# Altium project FEV-60_Motor_uC.PrjPcb
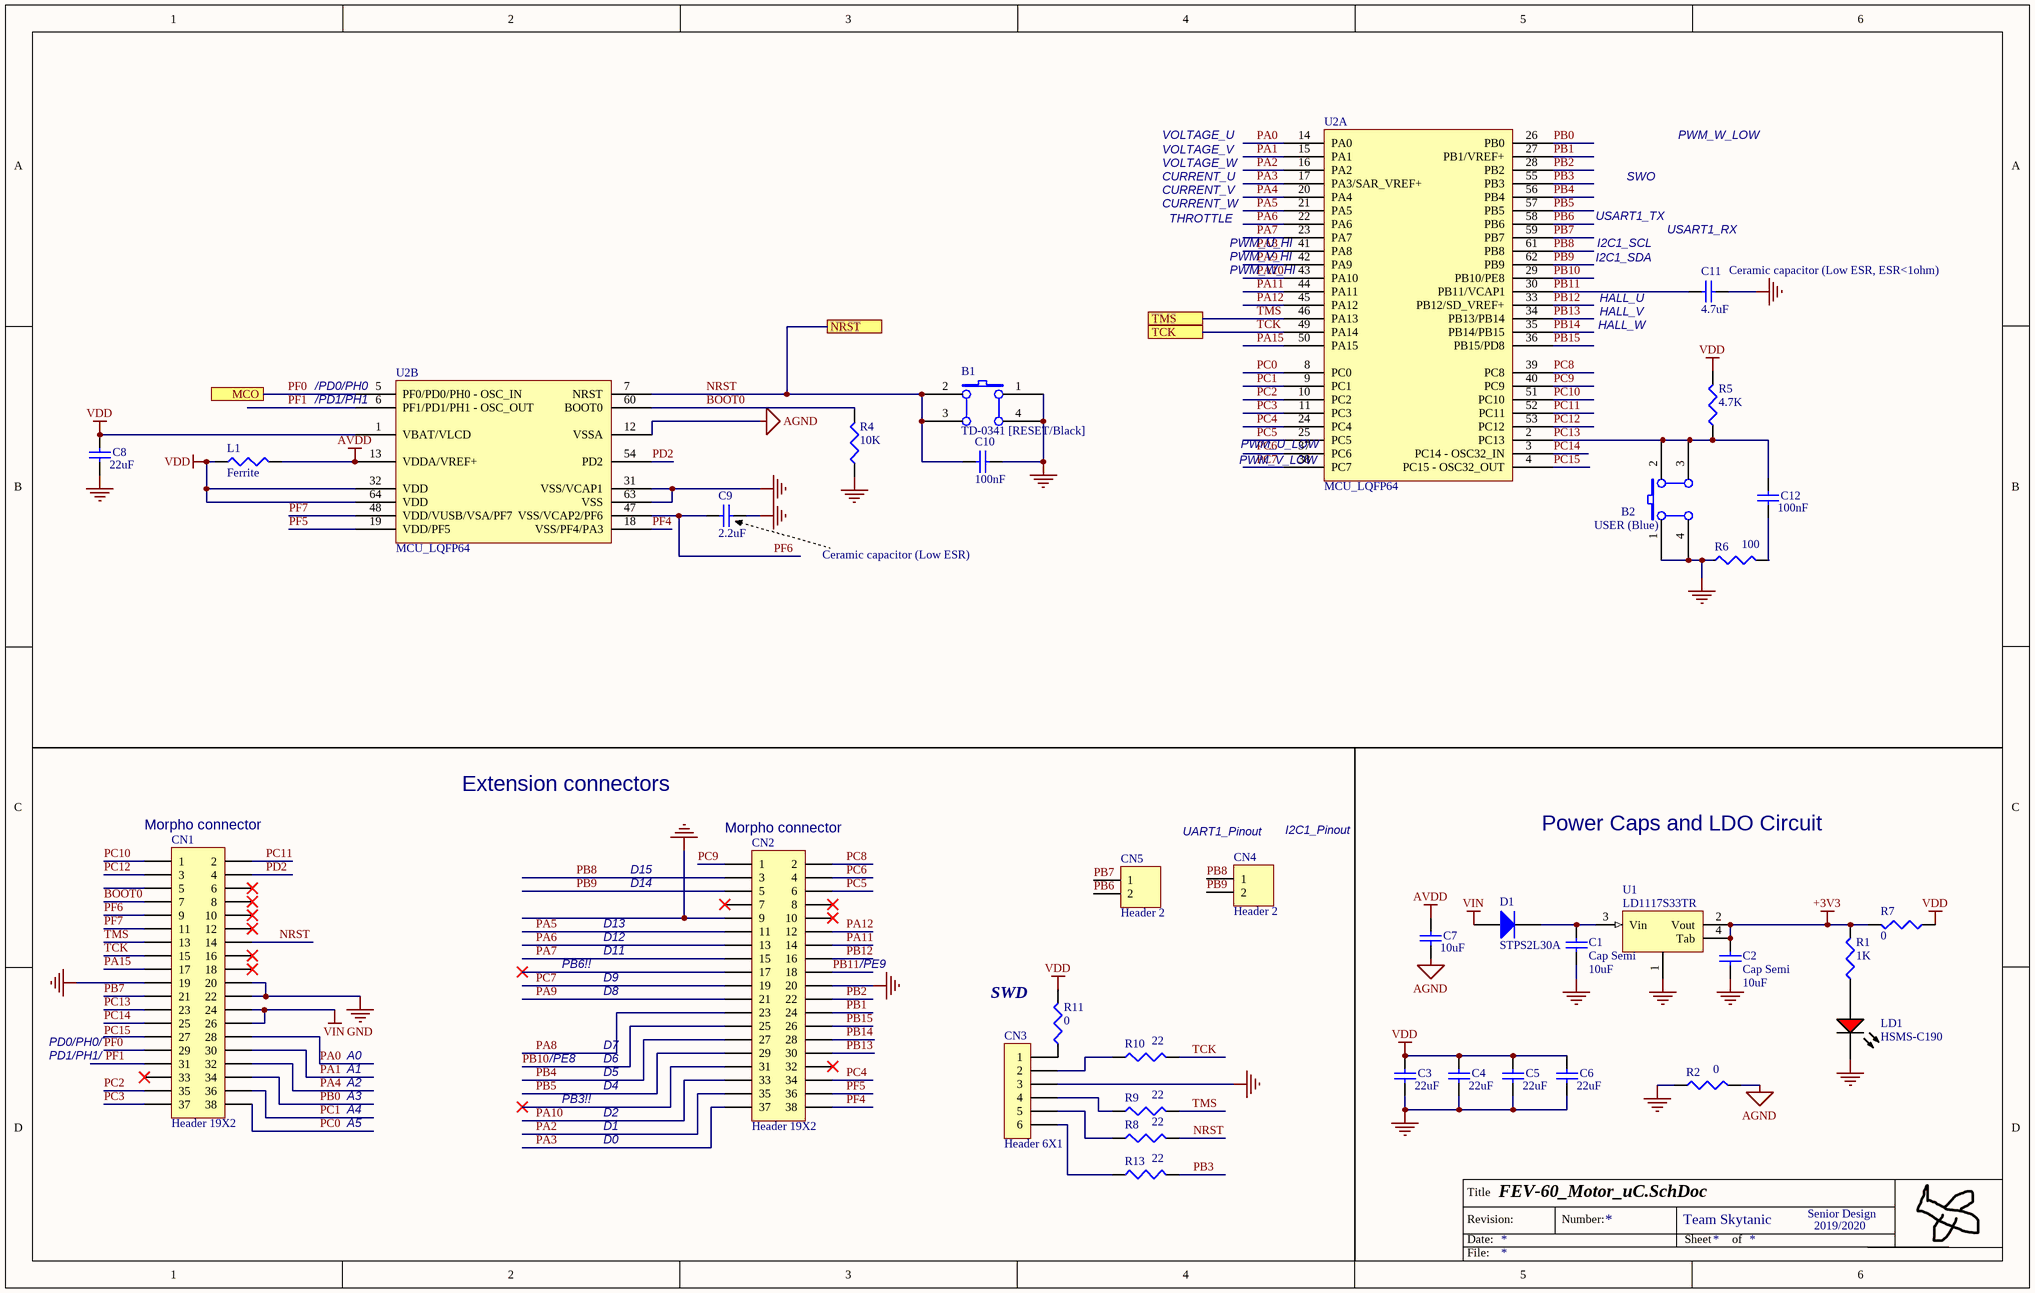
[diagram p0: FEV-60_Motor_uC.SchDoc]
1 sheet, 35 parts. Net scope: flat (ports and power ports of the same name join across sheets).
Board file: FEV-60_Motor_uC.PcbDoc

## Sheet FEV-60_Motor_uC.SchDoc
size B

### Parts
B1  TD-0341 [RESET/Black]  [Button]
B2  USER (Blue)  [Button]
C1  Cap Semi  value 10uF  [1608[0603]]
C2  Cap Semi  value 10uF  [1608[0603]]
C3  value 22uF  [1608[0603]]  (hidden comment: Cap Semi)
C4  value 22uF  [1608[0603]]  (hidden comment: Cap Semi)
C5  value 22uF  [1608[0603]]  (hidden comment: Cap Semi)
C6  value 22uF  [1608[0603]]  (hidden comment: Cap Semi)
C7  value 10uF  [1608[0603]]  (hidden comment: Cap Semi)
C8  value 22uF  [1608[0603]]  (hidden comment: Cap Semi)
C9  value 2.2uF  [1608[0603]]  (hidden comment: Cap Semi)
C10  value 100nF  [1608[0603]]  (hidden comment: Cap Semi)
C11  value 4.7uF  [1608[0603]]  (hidden comment: Cap Semi)
C12  value 100nF  [1608[0603]]  (hidden comment: Cap Semi)
CN1  Header 19X2  [HDR2X19]
CN2  Header 19X2  [HDR2X19]
CN3  Header 6X1  [HDR1X6]
CN4  Header 2  [HDR1X2]
CN5  Header 2  [HDR1X2]
D1  STPS2L30A  [STPS2L30A]
L1  Ferrite  [J1-0603]
LD1  HSMS-C190  [AVAG-HSMX-C190_V]
R1  value 1K  [J1-0603]  (hidden comment: Res3)
R2  value 0  [J1-0603]  (hidden comment: Res3)
R4  value 10K  [J1-0603]  (hidden comment: Res3)
R5  value 4.7K  [J1-0603]  (hidden comment: Res3)
R6  value 100  [J1-0603]  (hidden comment: Res3)
R7  value 0  [J1-0603]  (hidden comment: Res3)
R8  value 22  [J1-0603]  (hidden comment: Res3)
R9  value 22  [J1-0603]  (hidden comment: Res3)
R10  value 22  [J1-0603]  (hidden comment: Res3)
R11  value 0  [J1-0603]  (hidden comment: Res3)
R13  value 22  [J1-0603]  (hidden comment: Res3)
U1  LD1117S33TR  [LD1117S33TR]
U2  MCU_LQFP64  [STM32F030R8]  (parts A,B of 2)

### Ports
MCO, NRST, TCK, TMS

### Nets
+3V3: C2.2 R1.2 R7.2 U1.2(Vout) U1.4(Tab)
AGND: C7.1 R2.2 U2.12(VSSA)
AVDD: C7.2 L1.2 U2.13(VDDA/VREF+)
GND: B1.1(A0) B1.4(A1) B2.1(A0) B2.4(A1) C1.1 C2.1 C3.1 C4.1 C5.1 C6.1 C8.1 C9.1 C10.1 C11.1 CN1.19 CN1.20 CN1.22 CN2.9 CN2.20 CN3.3 LD1.2(K) R2.1 R4.1 R6.1 U1.1 U2.31(VSS/VCAP1) U2.63(VSS)
VDD: C3.2 C4.2 C5.2 C6.2 C8.2 L1.1 R5.2 R7.1 R11.2 U2.1(VBAT/VLCD) U2.32(VDD) U2.64(VDD)
VIN: CN1.24 CN1.26 D1.1(A)
BOOT0: CN1.7 R4.2 U2.60(BOOT0)
NRST: B1.2(B0) B1.3(B1) C10.2 CN1.14 R8.2 U2.7(NRST) ; port NRST
PA0: CN1.28 U2.14(PA0)
PA1: CN1.30 U2.15(PA1)
PA2: CN2.35 U2.16(PA2)
PA3: CN2.37 U2.17(PA3/SAR_VREF+)
PA4: CN1.32 U2.20(PA4)
PA5: CN2.11 U2.21(PA5)
PA6: CN2.13 U2.22(PA6)
PA7: CN2.15 U2.23(PA7)
PA8: CN2.23 U2.41(PA8)
PA9: CN2.21 U2.42(PA9)
PA10: CN2.33 U2.43(PA10)
PA11: CN2.14 U2.44(PA11)
PA12: CN2.12 U2.45(PA12)
PA15: CN1.17 U2.50(PA15)
PB0: CN1.34 U2.26(PB0)
PB1: CN2.24 U2.27(PB1/VREF+)
PB2: CN2.22 U2.28(PB2)
PB3: R13.2 U2.55(PB3)
PB4: CN2.27 U2.56(PB4)
PB5: CN2.29 U2.57(PB5)
PB6: CN5.2 U2.58(PB6)
PB7: CN1.21 CN5.1 U2.59(PB7)
PB8: CN2.3 CN4.1 U2.61(PB8)
PB9: CN2.5 CN4.2 U2.62(PB9)
PB10: CN2.25 U2.29(PB10/PE8)
PB11: C11.2 CN2.18 U2.30(PB11/VCAP1)
PB12: CN2.16 U2.33(PB12/SD_VREF+)
PB13: CN2.30 U2.34(PB13/PB14)
PB14: CN2.28 U2.35(PB14/PB15)
PB15: CN2.26 U2.36(PB15/PD8)
PC0: CN1.38 U2.8(PC0)
PC1: CN1.36 U2.9(PC1)
PC2: CN1.35 U2.10(PC2)
PC3: CN1.37 U2.11(PC3)
PC4: CN2.34 U2.24(PC4)
PC5: CN2.6 U2.25(PC5)
PC6: CN2.4 U2.37(PC6)
PC7: CN2.19 U2.38(PC7)
PC8: CN2.2 U2.39(PC8)
PC9: CN2.1 U2.40(PC9)
PC10: CN1.1 U2.51(PC10)
PC11: CN1.2 U2.52(PC11)
PC12: CN1.3 U2.53(PC12)
PC13: B2.2(B0) B2.3(B1) C12.2 CN1.23 R5.1 U2.2(PC13)
PC14: CN1.25 U2.3(PC14_-_OSC32_IN)
PC15: CN1.27 U2.4(PC15_-_OSC32_OUT)
PD2: CN1.4 U2.54(PD2)
PF0: CN1.29 U2.5(PF0/PD0/PH0_-_OSC_IN) ; port MCO
PF1: CN1.31 U2.6(PF1/PD1/PH1_-_OSC_OUT)
PF4: CN2.38 U2.18(VSS/PF4/PA3)
PF5: CN2.36 U2.19(VDD/PF5)
PF6: C9.2 CN1.9 U2.47(VSS/VCAP2/PF6)
PF7: CN1.11 U2.48(VDD/VUSB/VSA/PF7)
TCK: CN1.15 R10.2 U2.49(PA14) ; port TCK
TMS: CN1.13 R9.2 U2.46(PA13) ; port TMS
NetC1_2: C1.2 D1.2(K) U1.3(Vin)
NetC12_1: C12.1 R6.2
NetCN3_1: CN3.1 R11.1
NetCN3_2: CN3.2 R10.1
NetCN3_4: CN3.4 R9.1
NetCN3_5: CN3.5 R8.1
NetCN3_6: CN3.6 R13.1
NetLD1_1: LD1.1(A) R1.1

Not connected (* = marked no-connect by the designer): CN1 5 6* 8* 10* 12* 16* 18* 33*; CN2 7* 8* 10* 17* 31* 32*

### Notes on the sheet
- VOLTAGE_U
- VOLTAGE_V
- VOLTAGE_W
- PWM_W_LOW
- CURRENT_V
- CURRENT_W
- CURRENT_U
- THROTTLE
- USART1_TX
- SWO
- USART1_RX
- PWM_W_HI
- PWM_U_HI
- PWM_V_HI
- I2C1_SDA
- I2C1_SCL
- HALL_U
- (near C11) Ceramic capacitor (Low ESR, ESR<1ohm)
- HALL_W
- HALL_V
- (near U2) /PD0/PH0
- (near U2) /PD1/PH1
- PWM_V_LOW
- PWM_U_LOW
- Ceramic capacitor (Low ESR)
- (near CN1) Morpho connector
- Extension connectors
- (near CN2) Morpho connector
- UART1_Pinout
- (near CN4) I2C1_Pinout
- Power Caps and LDO Circuit
- D14
- D15
- PB6!!
- D13
- D12
- D11
- /PE9
- PD0/PH0/
- D8
- D9
- SWD
- PD1/PH1/
- A0
- A1
- A2
- A3
- A4
- /PE8
- PB3!!
- D4
- D5
- D6
- D7
- A5
- D0
- D1
- D2
- Title
- Date:
- Revision:
- Number:
- Team Skytanic
- Sheet
- of
- Senior Design
- 2019/2020
- File:

### Library data of the parts
B1 B2 = SW PUSHBUTTON: SE PUSHBUTTON
C1-C12 = Cap Semi: Capacitor (Semiconductor SIM Model); Published: 8-Jun-2000; LatestRevisionDate: 29-May-2009; LatestRevisionNote: IPC-7351 Footprint Added.; PackageReference: C1206; Publisher: Altium Limited; PackageDescription: Chip Capacitor
CN1 CN2 = Header 19X2: Header, 19-Pin, Dual row; Revision: 17-Jul-2002: Re-released for DXP Platform.; Publisher: Altium Limited
CN3 = Header 6X1: Header, 6-Pin, Single row; LatestRevisionDate: 17-Jul-2002; LatestRevisionNote: Re-released for DXP Platform.; Publisher: Altium Limited
CN4 CN5 = Header 2: Header, 2-Pin; LatestRevisionDate: 17-Jul-2002; LatestRevisionNote: Re-released for DXP Platform.; Publisher: Altium Limited
D1 = STPS2L30A: Manuf_1: STM; Provided: ST; Order: BAT60JFILM; ECCN_US/EU: EAR99/NEC; Revision: July-2002: Re-released for DXP Platform.; Manuf_Part_1: BAT60JFILM; Distrib: ST
L1 R1 R2 R4-R11 R13 = Res3: Resistor; Published: 8-Jun-2000; LatestRevisionDate: 29-May-2009; LatestRevisionNote: IPC-7351 Footprint Added.; PackageReference: J1-0603; Publisher: Altium Limited; PackageDescription: Chip Resistor
LD1 = CMP-2000-06427-1: LED Uni-Color Red, 52 mW, 20 mA, -40 to 85 degC, 2-Pin SMD, RoHS, Tape and Reel; Manufacturer: Avago; Reverse Voltage: 5V; Viewing Angle: 170deg; High Brightness: No; Lens Type: ColorlessDiffused; DELETED: Compliant; Product Height (mm): 0.8mm; Dominant Wave Length: 626nm; Number of  Elements: 1; Chip Material: GaP; Lum Intensity: 10mcd; Product Length (mm): 1.6mm; Forward Voltage: 2.6V; Power Dissipation: 52W; Shape Type: Rectangular; Forward Current: 25mA; Peak Wavelength: 630nm; Test Current (It): 20mA; Main Category: ChipLED; Lens Dimensions: 1x0.8x0.5mm; Pin Count: 2; Package Reference: HSMX-C190; Mounting Technology: SurfaceMount; Mounting: SurfaceMount; Datasheet URL: http://docs.avagotech.com/docs/AV02-0551EN; Package Type: ChipLed; Operating Temperature Classification: Industrial; Datasheet Version: 03/2012; Operating Temp Range: -40Cto85C; Emitting Color: Red; Rad Hardened: No; Manufacturer URL: http://www.avagotech.com/; Luminous Intensity: 10mcd; Package Description: 2-Pin Surface Mount Device, Body 1.6 x 0.8 mm, Height 0.9 mm; Type: Uni-Color; Packaging: TapeandReel; Product Depth (mm): 0.8mm
U1 = LD1117